# EAGLE schematic DoorSensor (EAGLE 8.7.0)
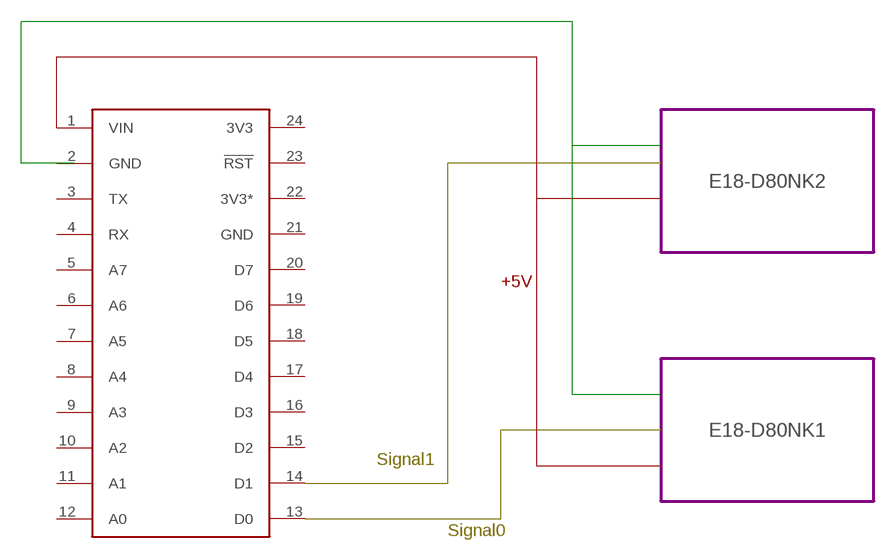
[diagram p0: schematic, sheet 1]

## Parts
U$1  SPARK_CORECORE  [SPARK_CORE]

## Module instances
E18-D80NK1 = E18-D80NK
E18-D80NK2 = E18-D80NK
Unconnected: U$1.3(TX) U$1.4(RX) U$1.5(A7) U$1.6(A6) U$1.7(A5) U$1.8(A4) U$1.9(A3) U$1.10(A2) U$1.11(A1) U$1.12(A0) U$1.13(D0) U$1.14(D1) U$1.15(D2) U$1.16(D3) U$1.17(D4) U$1.18(D5) U$1.19(D6) U$1.20(D7) U$1.23(!RST)

## Notes on the sheet
- +5V | GND
- Signal1
- Signal0

## Power pins joined to a net without a drawn wire
3V3: U$1.24(3V3)
3V3*: U$1.22(3V3*)
GND: U$1.2(GND) U$1.21(GND)
VIN: U$1.1(VIN)

## Library data of the parts
U$1 = Particle-Devices:SPARK_CORE: Particle/Spark Core WiFi development board footprint

## Module SENSOR
Ports: 

### Library data of the parts

## Module E18-D80NK
Ports: 

### Library data of the parts